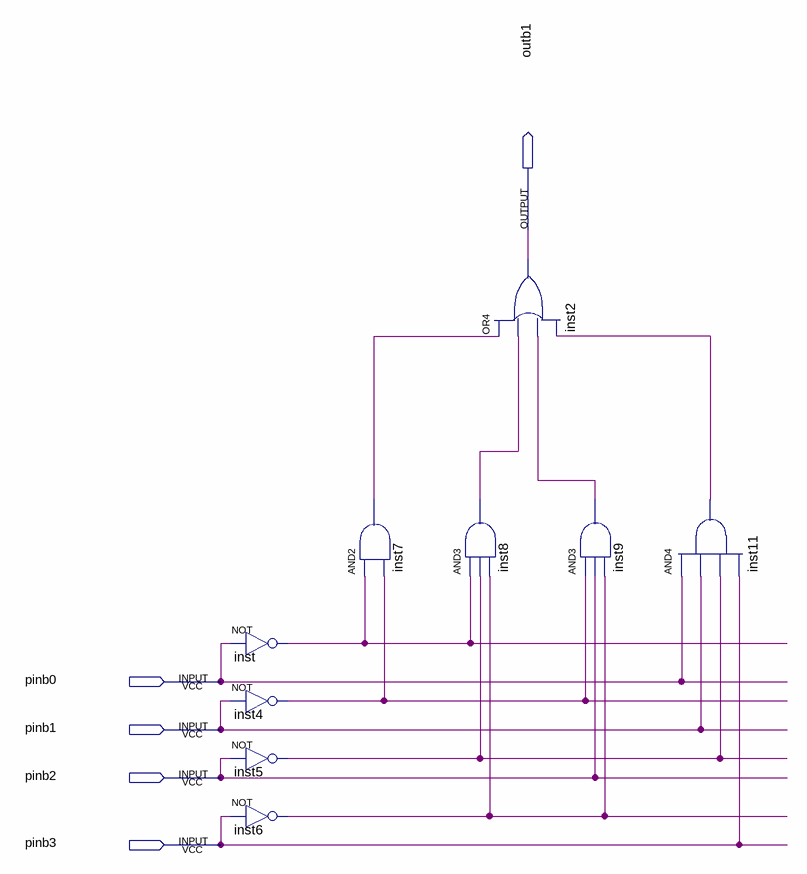
[diagram p0: schematic sheet]
// Quartus schematic OriginalB.bdf as structural Verilog: 9 symbols, 5 pins
module OriginalB (
  input  pinb0,
  input  pinb1,
  input  pinb2,
  input  pinb3,
  output outb1
);

  wire inst4_out, inst5_out, inst6_out, inst7_out, inst8_out, inst9_out, inst11_out, inst_out;

  not inst (inst_out, pinb0);
  not inst4 (inst4_out, pinb1);
  not inst5 (inst5_out, pinb2);
  not inst6 (inst6_out, pinb3);
  and inst7 (inst7_out, inst_out, inst4_out);
  or inst2 (outb1, inst7_out, inst8_out, inst9_out, inst11_out);
  and inst8 (inst8_out, inst_out, inst5_out, inst6_out);
  and inst9 (inst9_out, inst4_out, pinb2, inst6_out);
  and inst11 (inst11_out, pinb0, pinb1, inst5_out, pinb3);
endmodule
